# EAGLE design router-mini (EAGLE 9.1.1)
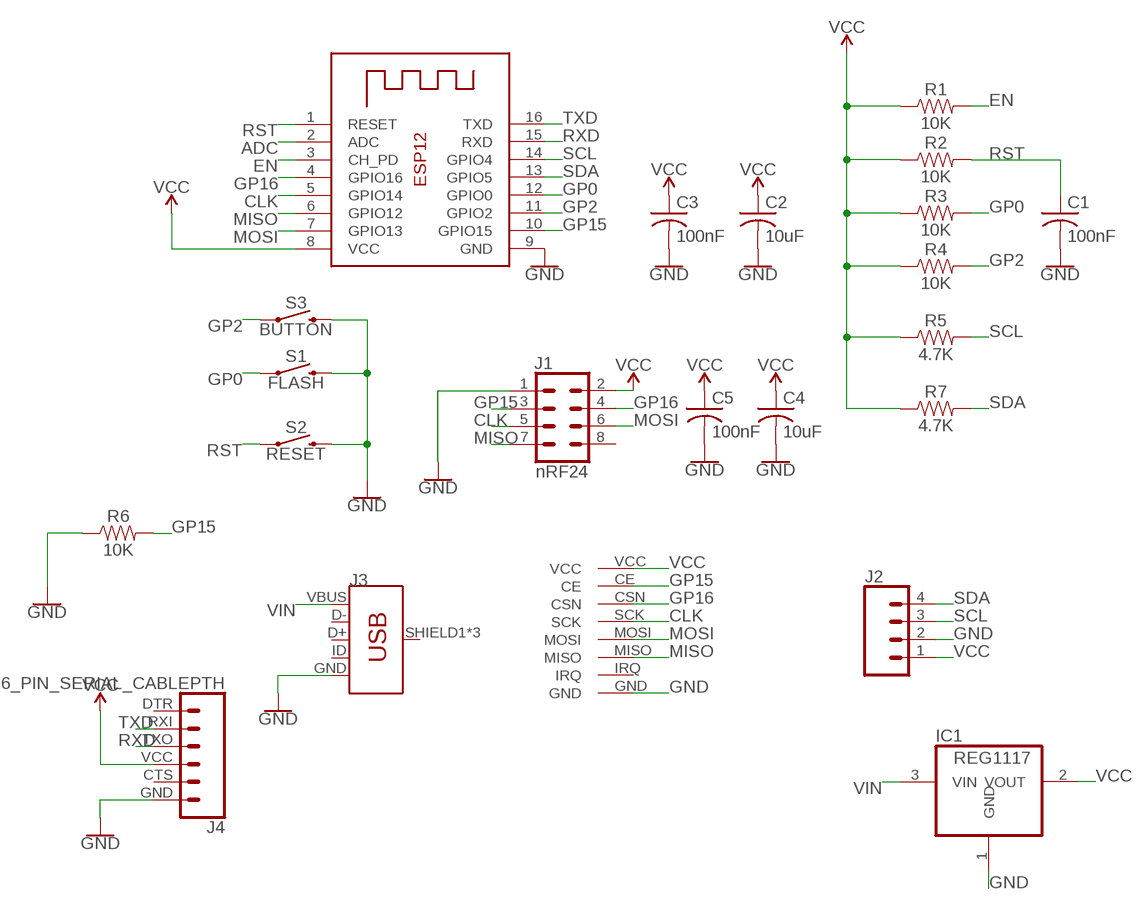
[diagram p0: schematic, sheet 1]

## Parts
C1  100nF  C-USC1206  [C1206]
C2  10uF  C-USC1206  [C1206]
C3  100nF  C-USC1206  [C1206]
C4  10uF  C-USC1206  [C1206]
C5  100nF  C-USC1206  [C1206]
IC1  REG1117  [SOT223]
J1  nRF24  CONN_04X2  [2X4]
J2  CONN_04  [1X04]
J3  USB_MICRO-B_FEMALE-SMT  [USB-B-MICRO-SMD]
J4  6_PIN_SERIAL_CABLEPTH  [FTDI_BASIC]
R1  10K  RESISTOR1206  [1206]
R2  10K  RESISTOR1206  [1206]
R3  10K  RESISTOR1206  [1206]
R4  10K  RESISTOR1206  [1206]
R5  4.7K  RESISTOR1206  [1206]
R6  10K  RESISTOR1206  [1206]
R7  4.7K  RESISTOR1206  [1206]
S1  FLASH  MOMENTARY-SWITCH-SPST-SMD-5.2-REDUNDANT  [TACTILE_SWITCH_SMD_5.2MM]
S2  RESET  MOMENTARY-SWITCH-SPST-SMD-5.2-REDUNDANT  [TACTILE_SWITCH_SMD_5.2MM]
S3  BUTTON  MOMENTARY-SWITCH-SPST-SMD-5.2-REDUNDANT  [TACTILE_SWITCH_SMD_5.2MM]
U$1  ML01SSMD-SOM  [ML01S]
X1  ESP-12  [ESP-12]

## Nets
ADC: X1.2(ADC)
CLK: J1.5 U$1.SCK X1.5(GPIO14)
EN: R1.2 X1.3(CH_PD)
GND: C1.2 C2.2 C3.2 C4.2 C5.2 IC1.1(GND) J1.1 J2.2 J3.GND J4.GND R6.1 S1.3 S1.4 S2.3 S2.4 S3.3 S3.4 U$1.GND X1.9(GND)
GP0: R3.2 S1.1 S1.2 X1.12(GPIO0)
GP2: R4.2 S3.1 S3.2 X1.11(GPIO2)
GP15: J1.3 R6.2 U$1.CE X1.10(GPIO15)
GP16: J1.4 U$1.CSN X1.4(GPIO16)
MISO: J1.7 U$1.MISO X1.6(GPIO12)
MOSI: J1.6 U$1.MOSI X1.7(GPIO13)
RST: C1.1 R2.2 S2.1 S2.2 X1.1(RESET)
RXD: J4.TXO X1.15(RXD)
SCL: J2.3 R5.2 X1.14(GPIO4)
SDA: J2.4 R7.2 X1.13(GPIO5)
TXD: J4.RXI X1.16(TXD)
VCC: C2.1 C3.1 C4.1 C5.1 IC1.2(VOUT) J1.2 J2.1 J4.VCC R1.1 R2.1 R3.1 R4.1 R5.1 R7.1 U$1.VCC X1.8(VCC)
VIN: IC1.3(VIN) J3.VBUS
Unconnected: J1.8 J3.D+ J3.D- J3.ID J3.SHIELD1(SHIELD) J3.SHIELD2(SHIELD) J3.SHIELD3(SHIELD) J4.CTS J4.DTR U$1.IRQ

## Library data of the parts
C1-C5 = adafruit:C-US: CAPACITOR, American symbol
IC1 = burr-brown:REG1117: 800mA and 1A Low Dropout (LDO) Positive Regulator 1.8V, 2.5V, 2.85V, 3.3V, 5V, and Adj; MPN: REG1117; OC_FARNELL: 1097566; OC_NEWARK: 14P6981
J1 = SparkFun-Connectors:CONN_04X2: Multi connection point. Often used as Generic Header-pin footprint for 0.1 inch spaced/style header connections On any of the 0.1 inch spaced packages, you can populate with these: Break Away Headers - Straight <https://www.sparkfun.com/products/116> (PRT-00116) Break Away Male Headers - Right Angle <https://www.sparkfun.com/products/553> (PRT-00553) Female Headers <https://www.sparkfun.com/products/115> (PRT-00115) Break Away Headers - Machine Pin <https://www.sparkfun.com/products/117> (PRT-00117) Break Away Female Headers - Swiss Machine Pin <https://www.sparkfun.com/products/743> (PRT-00743)
J2 = SparkFun-Connectors:CONN_04: Multi connection point. Often used as Generic Header-pin footprint for 0.1 inch spaced/style header connections On any of the 0.1 inch spaced packages, you can populate with these: Break Away Headers - Straight <https://www.sparkfun.com/products/116> (PRT-00116) Break Away Male Headers - Right Angle <https://www.sparkfun.com/products/553> (PRT-00553) Female Headers <https://www.sparkfun.com/products/115> (PRT-00115) Break Away Headers - Machine Pin <https://www.sparkfun.com/products/117> (PRT-00117) Break Away Female Headers - Swiss Machine Pin <https://www.sparkfun.com/products/743> (PRT-00743) For SCREWTERMINALS and SPRING TERMINALS visit here: Screw Terimnals on SparkFun.com <https://www.sparkfun.com/search/results?term=Screw+Terminals> (5mm/3.5mm/2.54mm spacing) This device is also useful as a general connection point to wire up your design to another part of your project. Our various solder wires solder well into these plated through hole pads. Hook-Up Wire - Assortment (Stranded, 22 AWG) <https://www.sparkfun.com/products/11375> (PRT-11375) Hook-Up Wire - Assortment (Solid Core, 22 AWG) <https://www.sparkfun.com/products/11367> (PRT-11367) View the entire wire category on our website here <https://www.sparkfun.com/categories/141> Special notes: Molex polarized connector foot print use with SKU : PRT-08231 with associated crimp pins and housings. 1MM SMD Version SKU: PRT-10208; PROD_ID: CONN-09696
J3 = SparkFun-Connectors:USB_MICRO-B: USB Type Micro-B Connector Male/female and PTH/SMT variants SparkFun Products: SparkFun microB USB Breakout <https://www.sparkfun.com/products/12035> SparkFun USB microB Plug Breakout <https://www.sparkfun.com/products/10031> SparkFun ESP8266 Thing <https://www.sparkfun.com/products/13231>; PROD_ID: CONN-11752
J4 = SparkFun-Connectors:6_PIN_SERIAL_CABLE: 6-pin header connection for use with the "FTDI BASIC" pinout - CABLE SIDE. Also known as "Arduino Serial Program Header". This is used on a design to provide a 6-pin connection point for serial communication usually from a USB cable (D+/D-) to these headers (RX/TX). It also has the remaining pins necessary for programming in the Arduino evironment (DTR, GND, and sometimes VCC). Note, this device has "CABLE" in the name. It is intended to be used on a design that usually lives on the end of your USB cable and prvides the converter chip (FTDI232 or FTDI231x) to commnicate serial RX/TX. The "sister" device, named "TARGET" is inteneded to be used on a design that contains a target micro-controller that you wish to program. You can populate with some of these: Female Headers <https://www.sparkfun.com/products/115> (PRT-00115) For reference (or to suit your programming needs) check out these designs: SparkFun FTDI Basic Breakout - 5V <https://www.sparkfun.com/products/9716> (DEV-09716) SparkFun FTDI Basic Breakout - 3.3V <https://www.sparkfun.com/products/9873> (DEV-09873) SparkFun FTDI SmartBasic <https://www.sparkfun.com/products/12935> (DEV-12935) SparkFun Beefy 3 - FTDI Basic Breakout <https://www.sparkfun.com/products/13746> (DEV-13746)
R1-R7 = SparkFun-Resistors:RESISTOR: Generic Resistor Package
S1-S3 = SparkFun-Switches:MOMENTARY-SWITCH-SPST: Momentary Switch (Pushbutton) - SPST Normally-open (NO) SPST momentary switches (buttons, pushbuttons). Variants PTH-12MM - 12mm square, through-hole Momentary Pushbutton Switch - 12mm Square <https://www.sparkfun.com/products/9190> (COM-09190) PTH-6.0MM, PTH-6.0MM-KIT - 6.0mm square, through-hole Mini Pushbutton Switch <https://www.sparkfun.com/products/97> (COM-00097) KIT package intended for soldering kit's - only one side of pads' copper is exposed. PTH-RIGHT-ANGLE-KIT - Right-angle, through-hole Right Angle Tactile Button <https://www.sparkfun.com/products/10791> - Used on SparkFun BigTime Watch Kit <https://www.sparkfun.com/products/11734> SMD-12MM - 12mm square, surface-mount Tactile Button - SMD (12mm) <https://www.sparkfun.com/products/12993> (COM-12993) Used on SparkFun PicoBoard <https://www.sparkfun.com/products/11888> SMD-4.5MM - 4.5mm Square Trackball Switch Used on SparkFun Blackberry Trackballer Breakout <https://www.sparkfun.com/products/13169> SMD-4.6MMX2.8MM - 4.60mm x 2.80mm, surface mount Used on SparkFun SAMD21 Mini Breakout <https://www.sparkfun.com/products/13664> SMD-5.2MM, SMD-5.2-REDUNDANT - 5.2mm square, surface-mount Mini Pushbutton Switch - SMD <https://www.sparkfun.com/products/8720> (COM-08720) Used on Arduino Pro Mini <https://www.sparkfun.com/products/11114> REDUNDANT package connects both switch circuits together SMD-6.0X3.5MM - 6.0 x 3.5mm, surface mount Momentary Reset Switch SMD <https://www.sparkfun.com/products/8229> (COM-08229) SMD-6.2MM-TALL - 6.2mm square, surface mount Tactile Button - SMD (6mm) <https://www.sparkfun.com/products/12992> Used on SparkFun Digital Sandbox <https://www.sparkfun.com/products/12651> SMD-RIGHT-ANGLE - Right-angle, surface mount Used on SparkFun Block for Intel® Edison - Arduino <https://www.sparkfun.com/products/13036>; PROD_ID: SWCH-08247; SF_SKU: COM-08720
U$1 = ebyte:ML01S
X1 = adafruit:ESP-12

## Board
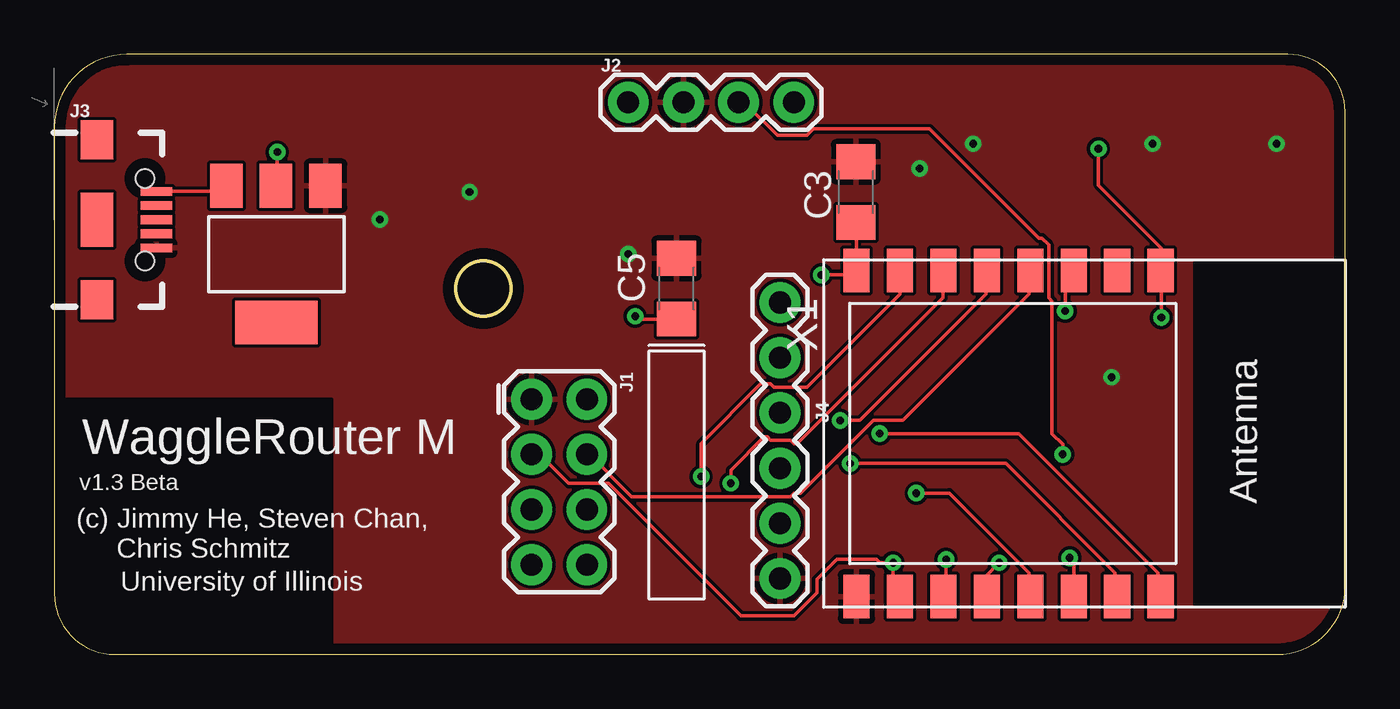
[diagram p1: board, top side]
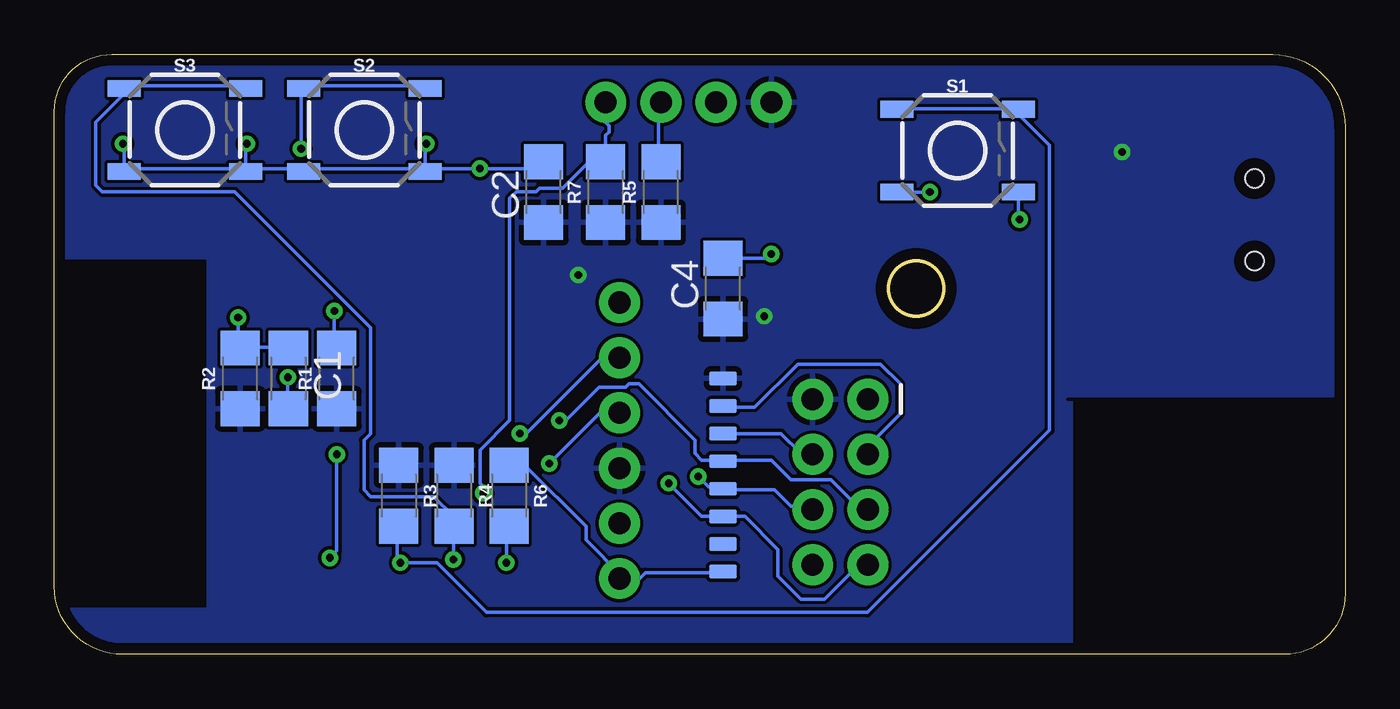
[diagram p2: board, bottom side, seen from below]

Size 59.42 x 27.61 mm. Coordinates in mm from the lower left corner, seen from the top.
Outline: 0,24.27 0,2.79 arc90 2.79,0 56.28,0 arc90 59.42,3.14 59.42,24.98 arc90 56.79,27.61 3.34,27.61 arc90 0,24.27
Outline: circle at 19.75,16.83 radius 1.27
Copper layers (1*16): Top 0.035mm / dielectric 1.5mm / Bottom 0.035mm
Design rules "default *": minimum track width 6mil, minimum drill 0.35mm, track to track 6mil, track to pad 6mil, pad to pad 6mil, via to via 6mil, smd to smd 6mil, copper to edge 20mil, drill to drill 6mil, minimum pad ring 10mil, minimum via ring 8mil, stop-mask expansion 4mil, vias tented up to drill 14mil, thermal gap 10mil

### Footprints (pad centres in the part's own frame; a part is rotated, then mirrored left to right if it is on the bottom)
C1206 = smd 1.6 x 1.8: 1 -1.4,0; 2 1.4,0
SOT223 = smd 1.499 x 2.007: 1 -2.261,-3.15; 2 0.025,-3.15; 3 2.311,-3.15 | smd 3.81 x 2.007: 4 0,3.15
2X4 = drill 1.016 pad 1.88: 1 -3.81,-1.27; 2 -3.81,1.27; 3 -1.27,-1.27; 4 -1.27,1.27; 5 1.27,-1.27; 6 1.27,1.27; 7 3.81,-1.27; 8 3.81,1.27
1X04 = drill 1.016 pad 1.88: 1 0,0; 2 2.54,0; 3 5.08,0; 4 7.62,0
USB-B-MICRO-SMD = smd 1.45 x 0.4: D+ 2.725,0; D- 2.725,0.65; GND 2.725,-1.3; ID 2.725,-0.65; VBUS 2.725,1.3 | smd 1.5 x 1.8: SHIELD1 0,3.685; SHIELD2 0,-3.685 | smd 1.5 x 2.5: SHIELD3 0,0 | hole 0.85: 2.2,1.9; 2.2,-1.9
FTDI_BASIC = drill 1.016 pad 1.88: CTS 10.16,0; DTR 0,0; GND 12.7,0; RXI 2.54,0; TXO 5.08,0; VCC 7.62,0
1206 = smd 1.6 x 1.8: 1 -1.4,0; 2 1.4,0
TACTILE_SWITCH_SMD_5.2MM = smd 1.524 x 0.762: 1 -2.794,1.905; 2 2.794,1.905; 3 -2.794,-1.905; 4 2.794,-1.905
ML01S = smd 1.27 x 0.635: CE 1.27,-1.27; CSN 1.27,-2.54; GND 1.27,-8.89; IRQ 1.27,-7.62; MISO 1.27,-6.35; MOSI 1.27,-5.08; SCK 1.27,-3.81; VCC 1.27,0
ESP-12 = smd 2 x 1.2: 1 -7.5,4.5; 2 -7.5,2.5; 3 -7.5,0.5; 4 -7.5,-1.5; 5 -7.5,-3.5; 6 -7.5,-5.5; 7 -7.5,-7.5; 8 -7.5,-9.5; 9 7.5,-9.5; 10 7.5,-7.5; 11 7.5,-5.5; 12 7.5,-3.5; 13 7.5,-1.5; 14 7.5,0.5; 15 7.5,2.5; 16 7.5,4.5

### Placement (x,y rotation side)
C1  48.64,12.7 270 bottom
C2  36.89,21.27 90 bottom
C3  36.89,21.27 90 top
C4  28.64,16.83 90 bottom
C5  28.64,16.83 90 top
IC1  10.22,18.41 180 top
J1  23.24,7.94 270 top
J2  26.42,25.4 0 top
J3  1.97,20 0 top
J4  33.4,16.19 270 top
R1  46.42,12.7 90 bottom
R2  50.86,12.7 90 bottom
R3  43.56,7.3 270 bottom
R4  41.02,7.3 270 bottom
R5  31.5,21.27 90 bottom
R6  38.48,7.3 270 bottom
R7  34.04,21.27 90 bottom
S1  17.84,23.18 0 bottom
S2  45.15,24.13 0 bottom
S3  53.4,24.13 0 bottom
U$1  29.91,12.7 0 bottom
X1  46.42,10.16 270 top

### Tracks (layer width: path | path; a pad name or v marks a point on that pad's centre or on a via)
CLK  (via drill 0.35)
  Top 0.152: v36.17,10.77 37.08,10.77 42.88,16.56 42.88,17.63 X1.5
  Bottom 0.152: J1.5 22,6.81 22.45,6.81 23.67,8.03 25.5,8.03 26.42,8.94 28.55,8.94 U$1.SCK 28.7,8.94 29.62,8.94 29.92,9.25 29.92,9.86 32.51,12.45 32.97,12.45 33.12,12.29 34.34,12.29 35.87,10.77 v36.17,10.77
EN  (via drill 0.35)
  Top 0.152: v46.53,15.8 46.53,17.32 46.84,17.63 X1.3
  Bottom 0.152: v46.53,15.8 46.53,14.12 R1.2
GND  (via drill 0.35)
  Bottom 0.152: S2.4 42.27,22.35 v39.83,22.35 37.24,22.35 36.93,22.66 C3.2 | S3.4 50.5,22.35 48.06,22.35 S2.3 47.9,22.35 42.42,22.35 S2.4 | S3.4 50.65,22.35 56.13,22.35 S3.3 56.2,23.5 v56.26,23.5 | U$1.GND 28.7,3.76 32.21,3.76 32.51,3.45 33.27,3.45 J4.GND 33.27,3.61 34.95,5.28 34.95,5.89 37.69,8.64 38.46,8.64 R6.1 | v48.67,12.75 48.67,11.38 C1.2 | S3.4 50.61,23.5 v50.55,23.5 | S2.4 42.35,23.5 v42.29,23.5 | S1.4 15.05,20 v14.99,20 | S1.3 v19.11,21.27 | C5.2 26.42,18.23 v26.42,18.41
  pour Top: -5.97,31.43 -5.97,-6.03 65.15,-6.03 65.15,30.48 64.52,31.11 -5.65,31.11
GP0  (via drill 0.35)
  Top 0.152: v43.48,4.22 42.88,3.61 42.88,2.69 X1.12
  Bottom 0.152: R3.2 43.64,5.89 43.64,4.37 v43.48,4.22 41.81,4.22 39.52,1.93 22,1.93 13.61,10.31 13.61,23.42 15.14,24.94 S1.2 15.14,25.09 20.62,25.09 S1.1
GP2  (via drill 0.35)
  Top 0.152: v41.05,4.37 41.05,2.69 X1.11
  Bottom 0.152: v41.05,4.37 41.05,5.89 R4.2 41.05,6.04 41.05,6.35 41.96,7.26 44.86,7.26 45.16,7.57 45.16,9.86 44.86,10.16 44.86,15.04 51.11,21.29 57.2,21.29 57.51,21.59 57.51,24.49 56.29,25.71 56.29,26.01 S3.1 56.13,26.16 50.65,26.16 S3.2
GP15  (via drill 0.35)
  Top 0.152: X1.10 38.91,2.69 38.61,3 v38.61,4.22 38,4.22 37.85,4.37 36.02,4.37 35.1,3.45 35.1,2.85 34.04,1.78 31.6,1.78 25.5,7.87 23.67,7.87 22.45,9.09 22,9.09 J1.3
  Bottom 0.152: v38.61,4.22 38.61,5.89 R6.2 | U$1.CE 28.55,11.38 27.18,11.38 25.2,13.36 21.39,13.36 20.47,12.45 20.47,11.07 21.84,9.7 21.84,9.25 J1.3
GP16
  Top 0.152: X1.4 44.86,17.63 44.86,16.56 39.07,10.77 37.69,10.77 34.34,7.42 34.04,7.42 33.88,7.26 26.57,7.26 24.59,9.25 J1.4
  Bottom 0.152: U$1.CSN 28.55,10.16 25.96,10.16 25.04,9.25 24.59,9.25 J1.4
MISO  (via drill 0.35)
  Top 0.152: v31.14,7.87 31.14,8.48 32.66,10.01 32.82,10.01 32.97,9.86 33.88,9.86 34.04,9.7 34.19,9.7 40.89,16.41 40.89,17.63 X1.6
  Bottom 0.152: J1.7 22,4.06 22.45,4.06 23.98,2.54 25.04,2.54 26.11,3.61 26.11,4.83 27.63,6.35 28.55,6.35 U$1.MISO 28.7,6.35 29.62,6.35 v31.14,7.87
MOSI  (via drill 0.35)
  Top 0.152: v29.77,8.18 29.77,9.7 32.51,12.45 32.97,12.45 33.12,12.29 34.65,12.29 38.91,16.56 38.91,17.63 X1.7
  Bottom 0.152: J1.6 24.59,6.81 25.5,6.81 26.26,7.57 28.55,7.57 U$1.MOSI 28.7,7.72 29.31,7.72 v29.77,8.18
N$1
  cutout Top: -0.57,11.75 12.76,11.75 12.76,-0.95 -0.57,-0.95
N$2
  cutout Bottom: -0.57,12.07 -0.57,-0.64 12.45,-0.64 12.45,11.75 12.76,11.75 -0.57,11.75
RST  (via drill 0.35)
  Top 0.152: v50.95,15.49 50.95,17.63 X1.1 50.95,17.78 50.95,18.69 48.06,21.59 v48.06,23.27
  Bottom 0.152: S2.2 42.42,26.16 47.9,26.16 S2.1 48.06,26.01 v48.06,23.27 | C1.1 48.67,14.12 50.8,14.12 R2.2 50.95,14.12 v50.95,15.49
RXD  (via drill 0.35)
  Top 0.152: v36.63,8.79 43.79,8.79 48.82,3.76 48.82,2.69 X1.15
  Bottom 0.152: v36.63,8.79 34.34,11.07 33.43,11.07 J4.TXO
SCL  (via drill 0.35)
  Top 0.152: 45.92,10.16 45.92,16.26 45.77,16.41 45.77,18.85 45.47,19.15 45.31,19.15 40.28,24.18 34.95,24.18 34.65,23.88 33.27,23.88 31.75,25.4 31.6,25.4 J2.3 | 45.92,10.16 | 45.92,10.16 46.42,9.67 v46.42,9.21 | v46.74,4.45 46.92,4.26 X1.14
  Bottom 0.152: R5.2 31.6,22.81 31.6,25.4 J2.3 | v46.42,9.21 46.42,4.76 v46.74,4.45
SDA  (via drill 0.35)
  Top 0.152: v39.68,7.42 41.2,7.42 44.86,3.76 44.86,2.69 X1.13
  Bottom 0.152: J2.4 34.04,24.49 33.88,24.33 33.88,24.03 34.04,23.88 34.04,22.81 R7.2 34.04,22.66 34.8,22.66 36.02,21.44 37.08,21.44 37.24,21.29 38.15,21.29 38.46,20.98 38.46,10.77 39.83,9.4 39.83,7.87 39.52,7.57 v39.68,7.42
TXD  (via drill 0.35)
  Top 0.152: v38,10.16 44.4,10.16 50.8,3.76 50.8,2.69 X1.16
  Bottom 0.152: v38,10.16 37.69,10.16 34.34,13.51 33.43,13.51 J4.RXI
VCC  (via drill 0.35)
  Top 0.152: C3.1 36.93,19.76 36.93,17.78 X1.8 36.92,17.46 v35.31,17.46 | v10.26,23.11 10.26,21.59 IC1.2 | C5.1 26.73,15.43 v26.73,15.56
  pour Bottom: -6.6,-7.94 66.74,-7.94 67.06,-7.62 67.06,32.07 66.42,32.7 -6.6,32.38
VIN
  Top 0.152: J3.VBUS 7.65,21.3 IC1.3

### Text on the board
tPlace: WaggleRouter M | v1.3 Beta | (c) Jimmy He, Steven Chan, / Chris Schmitz | University of Illinois